# EAGLE design Sensors_PCB_v2.1 (EAGLE 7.3.0)
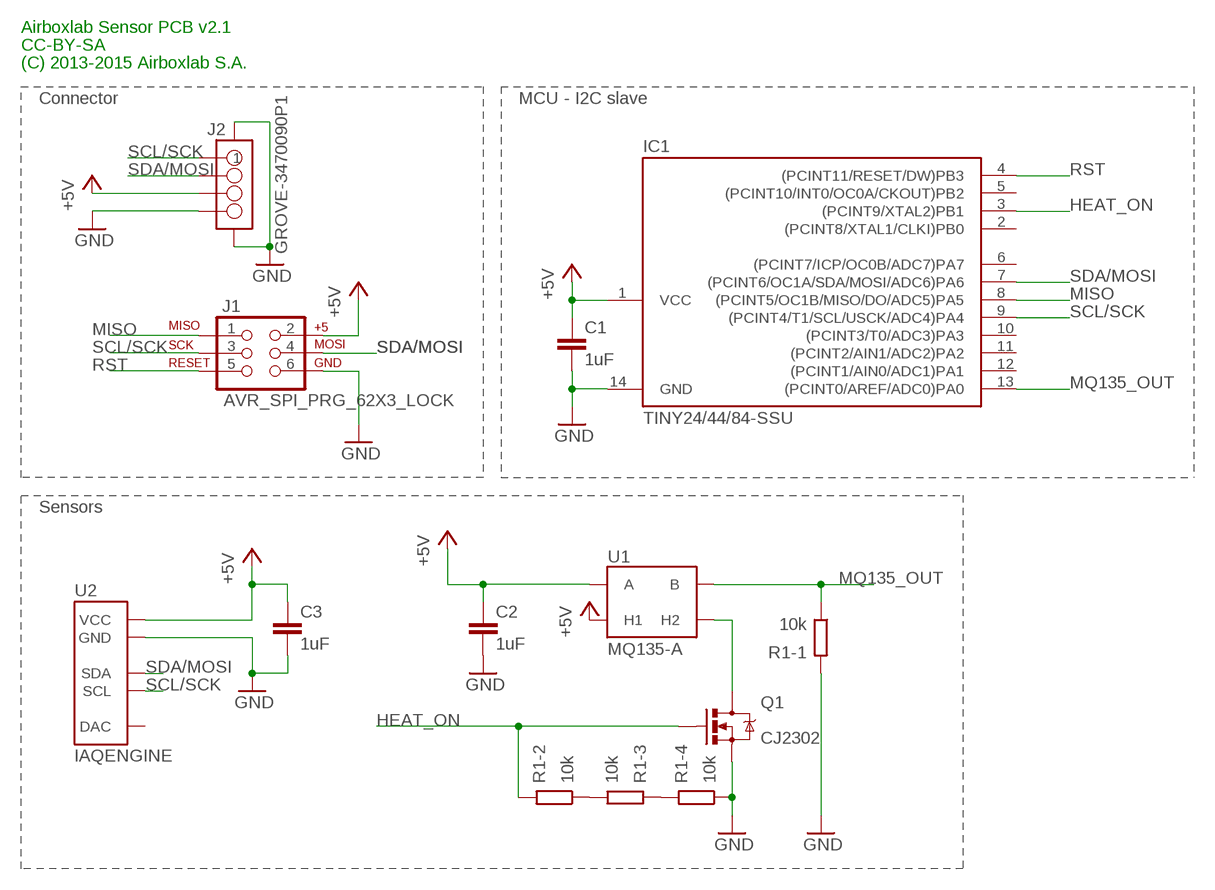
[diagram p0: schematic, sheet 1]

## Parts
C1  1uF  C0603  [0603_N]
C2  1uF  C0603  [0603_N]
C3  1uF  C0603  [0603_N]
IC1  TINY24/44/84-SSU  [SOIC14]
J1  AVR_SPI_PRG_62X3_LOCK  [2X3_LOCK]
J2  GROVE-3470090P1  GROVE-4P-2.0-SMD-FEMALE-REINFORCE-3470090P1  [4P-SMD-2.0]
Q1  CJ2302  MOSFET_N_SOT23-3  [SOT-23-3_N/SSOT-3_N]
R1  10k  R_4  [R_0603_80P_4]
U1  MQ135-A  [MQ135-A]
U2  IAQENGINE  [IAQENGINE]

## Nets
+5V: C1.1 C2.1 C3.1 IC1.1(VCC) J1.2 J2.3 U1.1(A) U1.2(H1) U1.3(A) U2.6(VCC)
GND: C1.2 C2.2 C3.2 IC1.14(GND) J1.6 J2.4 J2.SS1 J2.SS2 Q1.2(S) R1.4 R1.8 U2.3(GND)
HEAT_ON: IC1.3((PCINT9/XTAL2)PB1) Q1.1(G) R1.7
MISO: IC1.8((PCINT5/OC1B/MISO/DO/ADC5)PA5) J1.1
MQ135_OUT: IC1.13((PCINT0/AREF/ADC0)PA0) R1.1 U1.4(B) U1.6(B)
N$1: R1.5 R1.6
N$2: R1.2 R1.3
N$8: Q1.3(D) U1.5(H2)
RST: IC1.4((PCINT11/RESET/DW)PB3) J1.5
SCL/SCK: IC1.9((PCINT4/T1/SCL/USCK/ADC4)PA4) J1.3 J2.1 U2.2(SCL)
SDA/MOSI: IC1.7((PCINT6/OC1A/SDA/MOSI/ADC6)PA6) J1.4 J2.2 U2.4(SDA)
Unconnected: IC1.2((PCINT8/XTAL1/CLKI)PB0) IC1.5((PCINT10/INT0/OC0A/CKOUT)PB2) IC1.6((PCINT7/ICP/OC0B/ADC7)PA7) IC1.10((PCINT3/T0/ADC3)PA3) IC1.11((PCINT2/AIN1/ADC2)PA2) IC1.12((PCINT1/AIN0/ADC1)PA1) U2.1(DAC)

## Notes on the sheet
- Airboxlab Sensor PCB v2.1
- CC-BY-SA
- (C) 2013-2015 Airboxlab S.A.
- Connector | MCU - I2C slave
- Sensors

## Library data of the parts
C1-C3 = Xevelabs:C: Non-polarized Capacitor
IC1 = avr-5:TINY24/44/84
J1 = SparkFun-Connectors:AVR_SPI_PRG_6: AVR ISP 6 Pin This is the reduced ISP connector for AVR programming. Common on Arduino. This footprint will take up less PCB space and can be used with a 10-pin to 6-pin adapter such as SKU: BOB-08508
J2 = OPL:GROVE-4P-2.0-SMD-FEMALE-REINFORCE
Q1 = Xevelabs:MOSFET_N
R1 = AirQuality-sensors:R_4
U1 = AirQuality-sensors:MQ135: MQ135 gas sensor
U2 = AirQuality-sensors:IAQENGINE: iAQ-engine sensor

## Board
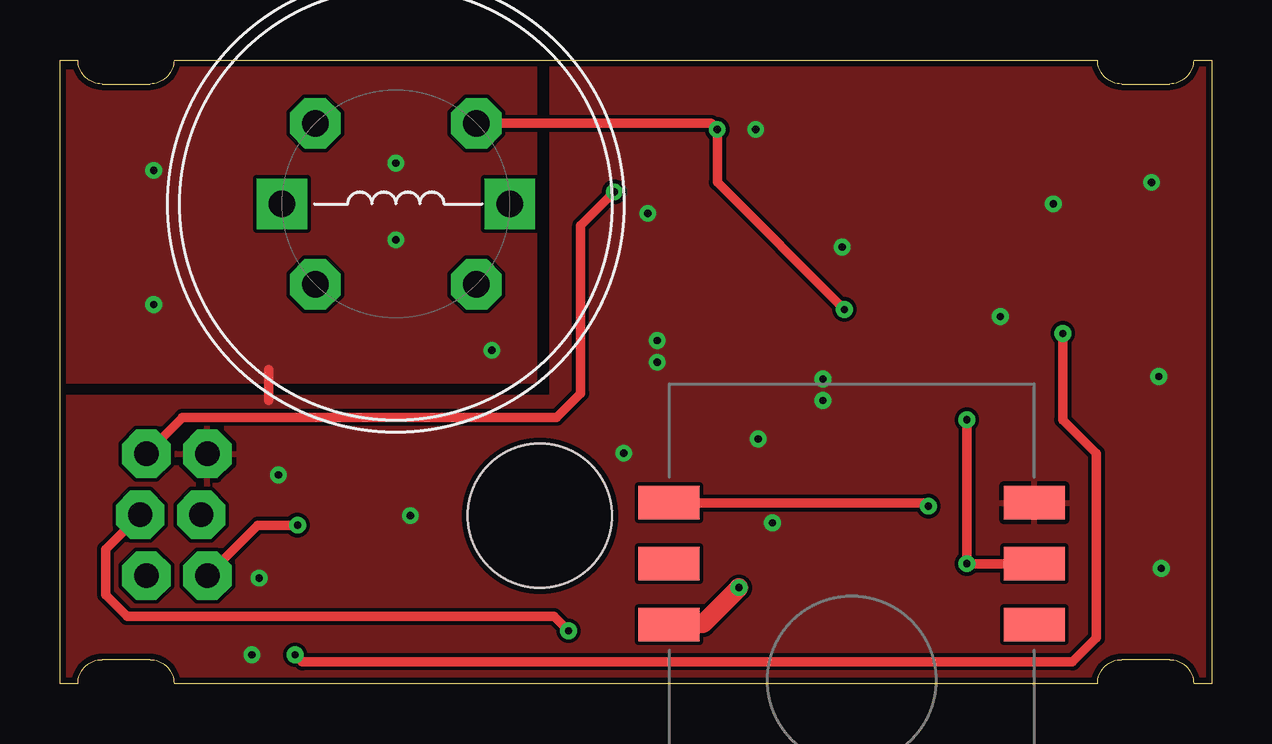
[diagram p1: board, top side]
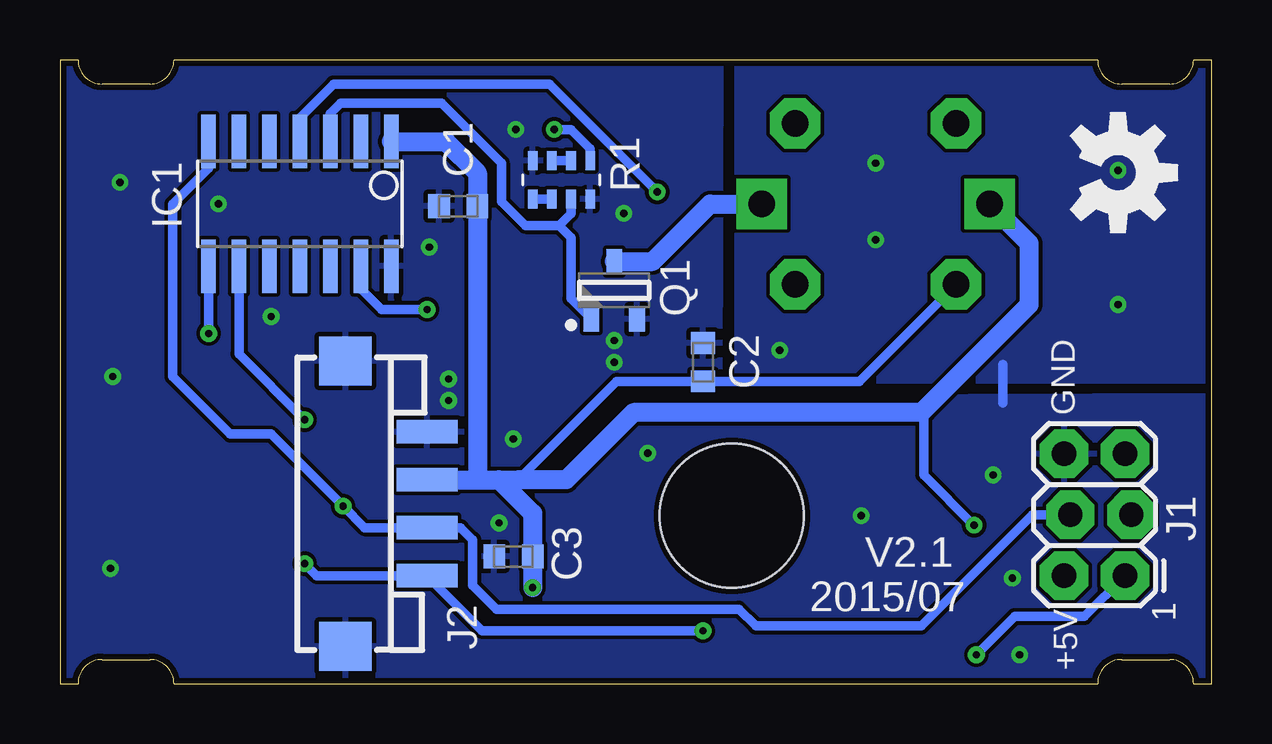
[diagram p2: board, bottom side, seen from below]

Size 48 x 26 mm. Coordinates in mm from the lower left corner, seen from the top.
Outline: 0,26 0.75,26 arc90 1.75,25 3.75,25 arc90 4.75,26 43.25,26 arc90 44.25,25 46.25,25 arc90 47.25,26 48,26 48,0 47.25,0 arc90 46.25,1 44.25,1 arc90 43.25,0 4.75,0 arc90 3.75,1 1.75,1 arc90 0.75,0 0,0 0,26
Copper layers (1*16): Top 0.035mm / dielectric 1.55mm / Bottom 0.035mm
Design rules "Xevelabs_6mil_eurocircuits *": minimum track width 0.15mm, minimum drill 0.25mm, track to track 0.155mm, track to pad 0.155mm, pad to pad 0.155mm, via to via 0.155mm, smd to smd 0mil, copper to edge 0.25mm, drill to drill 0.25mm, minimum pad ring 0mil, minimum via ring 0.2mm, stop-mask expansion 0mil, vias tented up to drill 100mil, thermal gap 0.2mm
Holes 6 mm at 20,7

### Footprints (pad centres in the part's own frame; a part is rotated, then mirrored left to right if it is on the bottom)
0603_N = smd 0.9 x 1: 1 -0.8,0; 2 0.8,0
SOIC14 = smd 0.61 x 2.21: 1 -3.81,-2.603; 2 -2.54,-2.603; 3 -1.27,-2.603; 4 0,-2.603; 5 1.27,-2.603; 6 2.54,-2.603; 7 3.81,-2.603; 8 3.81,2.603; 9 2.54,2.603; 10 1.27,2.603; 11 0,2.603; 12 -1.27,2.603; 13 -2.54,2.603; 14 -3.81,2.603
2X3_LOCK = drill 1.016 pad 1.88 octagon: 1 0,0; 2 0,2.54; 3 2.54,-0.254; 4 2.54,2.286; 5 5.08,0; 6 5.08,2.54
4P-SMD-2.0 = smd 0.965 x 2.54: 1 -3,0; 2 -1,0; 3 1,0; 4 3,0 | smd 2.032 x 2.184: SS1 -5.946,3.4; SS2 5.946,3.4
SOT-23-3_N/SSOT-3_N = smd 1.05 x 0.65: 1 -1.2,0.95; 2 -1.2,-0.95; 3 1.2,0
R_0603_80P_4 = smd 0.4 x 0.8: 1 -1.2,-0.8; 2 -0.4,-0.8; 3 0.4,-0.8; 4 1.2,-0.8; 5 1.2,0.8; 6 0.4,0.8; 7 -0.4,0.8; 8 -1.2,0.8
MQ135-A = drill 1.1 octagon: 1 -3.36,3.36; 3 -3.36,-3.36; 4 3.36,-3.36; 6 3.36,3.36 | drill 1.1 square: 2 -4.75,0; 5 4.75,0
IAQENGINE = smd 2.54 x 1.4: 1 -7.62,2.54; 2 -7.62,0; 3 -7.62,-2.54; 4 7.62,-2.54; 5 7.62,0; 6 7.62,2.54

### Placement (x,y rotation side)
C1  31.4,19.9 180 bottom
C2  21.2,13.4 90 bottom
C3  29.1,5.3 180 bottom
IC1  38,20 180 bottom
J1  3.6,4.5 90 bottom
J2  32.7,7.5 90 bottom
Q1  24.9,16.4 90 bottom
R1  27.1,21 180 bottom
U1  14,20 0 top
U2  33,5 180 top
U$1  [OSHW-LOGO-M]  3.9,21.3 270 bottom

### Tracks (layer width: path | path; a pad name or v marks a point on that pad's centre or on a via)
+5V  (via drill 0.3)
  Top 0.4: v9.9,6.6 8.24,6.6 J1.2
  Top 0.8: v28.3,4 26.8,2.5 25.42,2.5 U2.6
  Bottom 0.4: 28.9,8.5 24.8,12.6 C2.1 14.68,12.6 U1.3 | 12,11.4 12,8.7 v9.9,6.6
  Bottom 0.8: J2.3 30.6,8.5 | 29.7,8.5 28.3,7.1 C3.1 v28.3,4 | 29.7,8.5 28.9,8.5 26.9,8.5 24.1,11.3 12.1,11.3 12,11.4 7.6,15.8 7.6,18.35 U1.2 | IC1.1 31.9,22.6 30.6,21.3 C1.1 30.6,8.5 | 30.6,8.5 29.7,8.5
GND  (via drill 0.3)
  Top 0.4: 8.7,13.1 8.7,11.8
  Bottom 0.4: 8.7,13.3 8.7,11.7
  other vias: 31.8,12.7 29.7,6.7 29,23.1 24.9,14.3 24.9,13.4 8,1.2 9.1,8.7 14.6,7 23.5,9.6 32.6,18.2 41.4,20 39.2,15.3 29.1,10.2 24.5,19.6 45.9,4.8 45.8,12.8 45.5,20.9 18,13.9 14,21.7 3.9,15.8 14,18.5 3.9,21.4 8.3,4.4 31.8,11.8
  pour Top: 20.3,-4.7 50.3,-6.1 49.8,28.5 20.5,28.4 20.5,11.9 0,11.9 -0.7,11.5 -0.7,-1.7 20.1,-4.5
  pour Bottom: 50.05,27.75 49.65,-1.95 21.2,-2.3 20.1,-1.2 0.5,-1.2 0.3,-1 -0.2,12 20.5,11.9 20.45,27
  pour Top: -0.4,12.7 19.7,12.7 19.7,26.2 -0.1,26.2
  pour Bottom: -0.4,12.7 19.7,12.7 19.7,26.2 -0.1,26.2
HEAT_ON
  Bottom 0.4: Q1.1 26.7,16.05 26.7,18.6 27.2,19.1 | IC1.3 36.73,23.77 36.3,24.2 32.1,24.2 29.6,21.7 29.6,20.1 28.6,19.1 27.2,19.1 | R1.7 26.7,19.6 27.2,19.1
MISO  (via drill 0.3)
  Top 0.4: v41.8,14.6 41.8,11 43.2,9.6 43.2,1.9 42.2,0.9 10.1,0.9 v9.8,1.2
  Bottom 0.4: IC1.8 v41.81,14.61 v41.8,14.6 | v9.8,1.2 8.2,2.8 5.3,2.8 J1.1
MQ135_OUT  (via drill 0.3)
  Top 0.4: U1.6 27.14,23.36 v27.4,23.1 27.4,20.9 v32.7,15.6
  Bottom 0.4: v27.4,23.1 26.7,23.1 25.9,22.3 R1.1 | v32.7,15.6 34.6,15.6 35.4,16.4 35.4,17.34 IC1.13
N$1
  Bottom 0.4: R1.5 R1.6
N$2
  Bottom 0.4: R1.3 R1.2
N$8
  Bottom 0.8: Q1.3 23.3,17.6 20.9,20 U1.5
RST  (via drill 0.3)
  Top 0.4: v23.1,20.5 21.7,19.1 21.7,12.1 20.7,11.1 5.1,11.1 5.1,11.08 J1.5
  Bottom 0.4: v23.1,20.5 27.6,25 36.6,25 38,23.6 IC1.4
SCL/SCK  (via drill 0.3)
  Top 0.4: U2.2 v37.8,5 v37.8,11 | v21.2,2.2 20.6,2.8 2.8,2.8 1.9,3.7 1.9,5.6 J1.3
  Bottom 0.4: v37.8,5 37.3,4.5 J2.1 30.4,2.2 v21.2,2.2 | IC1.9 40.54,13.74 v37.8,11
SDA/MOSI  (via drill 0.3)
  Top 0.4: U2.4 36.06,7.54 v36.2,7.4
  Bottom 0.4: IC1.7 41.81,21.49 43.3,20 43.3,12.8 40.9,10.4 39.2,10.4 v36.2,7.4 35.3,6.5 J2.2 31.3,6.5 30.8,6 30.8,4.1 29.8,3.1 19.7,3.1 19,2.4 12.1,2.4 7.46,7.04 J1.4

### Text on the board
bPlace: GND | V2.1 | 1 | +5V | 2015/07
bNames: R1